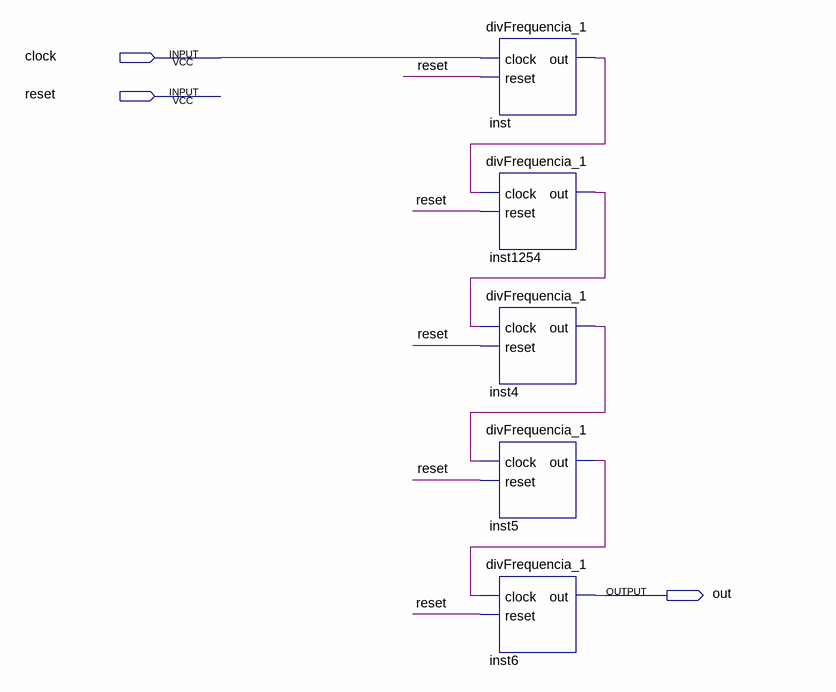
[diagram p0: schematic sheet]
// Quartus schematic divFrequencia_5.bdf as structural Verilog: 5 symbols, 3 pins
module divFrequencia_5 (
  input  clock,
  input  reset,
  output out
);

  wire inst4_out, inst5_out, inst1254_out, inst_out;

  divFrequencia_1 inst (.clock(clock), .reset(reset), .out(inst_out));
  divFrequencia_1 inst1254 (.clock(inst_out), .reset(reset), .out(inst1254_out));
  divFrequencia_1 inst4 (.clock(inst1254_out), .reset(reset), .out(inst4_out));
  divFrequencia_1 inst5 (.clock(inst4_out), .reset(reset), .out(inst5_out));
  divFrequencia_1 inst6 (.clock(inst5_out), .reset(reset), .out(out));
endmodule
